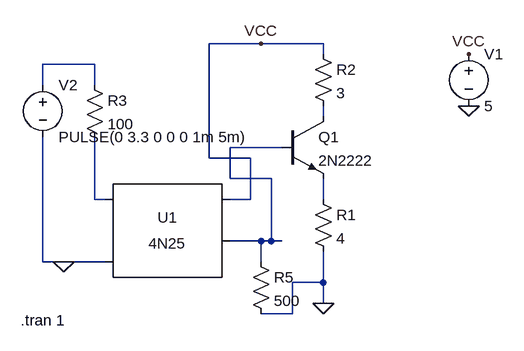
[diagram p0: schematic Motor Driver.asc]
Motor Driver.asc, the LTspice schematic file:
Version 4
SHEET 1 880 680
WIRE 144 0 64 0
WIRE 240 0 144 0
WIRE 240 16 240 0
WIRE -112 32 -192 32
WIRE -192 64 -192 32
WIRE -112 64 -112 32
WIRE 240 112 240 96
WIRE 176 160 96 160
WIRE 64 176 64 0
WIRE 128 176 64 176
WIRE 96 208 96 160
WIRE 160 208 96 208
WIRE -112 240 -112 144
WIRE -96 240 -112 240
WIRE 128 240 128 176
WIRE 128 240 96 240
WIRE 240 240 240 208
WIRE 144 304 96 304
WIRE 160 304 160 208
WIRE 160 304 144 304
WIRE 176 304 160 304
WIRE -192 336 -192 144
WIRE -160 336 -192 336
WIRE -96 336 -160 336
WIRE 144 336 144 304
WIRE 240 368 240 320
WIRE 240 368 192 368
WIRE 240 400 240 368
WIRE 192 416 192 368
WIRE 192 416 144 416
FLAG 240 400 0
FLAG 464 96 0
FLAG 144 0 VCC
FLAG 464 16 VCC
FLAG -160 336 0
SYMBOL npn 176 112 R0
SYMATTR InstName Q1
SYMATTR Value 2N2222
SYMBOL res 224 224 R0
SYMATTR InstName R1
SYMATTR Value 4
SYMBOL Optos\\4N25 0 304 R0
SYMATTR InstName U1
SYMBOL voltage 464 0 R0
WINDOW 123 0 0 Left 0
WINDOW 39 0 0 Left 0
SYMATTR InstName V1
SYMATTR Value 5
SYMBOL voltage -192 48 R0
WINDOW 123 0 0 Left 0
WINDOW 39 0 0 Left 0
SYMATTR InstName V2
SYMATTR Value PULSE(0 3.3 0 0 0 1m 5m)
SYMBOL res -128 48 R0
SYMATTR InstName R3
SYMATTR Value 100
SYMBOL res 128 320 R0
SYMATTR InstName R5
SYMATTR Value 500
SYMBOL res 224 0 R0
SYMATTR InstName R2
SYMATTR Value 3
TEXT -226 426 Left 2 !.tran 1

The netlist it stands for:
* Motor Driver.asc
Q1 N002 N003 N005 0 2N2222
R1 N005 0 4
XU1 N004 0 VCC N003 NC_01 4N25
V1 VCC 0 5
V2 N001 0 PULSE(0 3.3 0 0 0 1m 5m)
R3 N001 N004 100
R5 N003 0 500
R2 VCC N002 3
.model NPN NPN
.model PNP PNP
.lib standard.bjt
.tran 1
.lib 4N25.sub
.backanno
.end